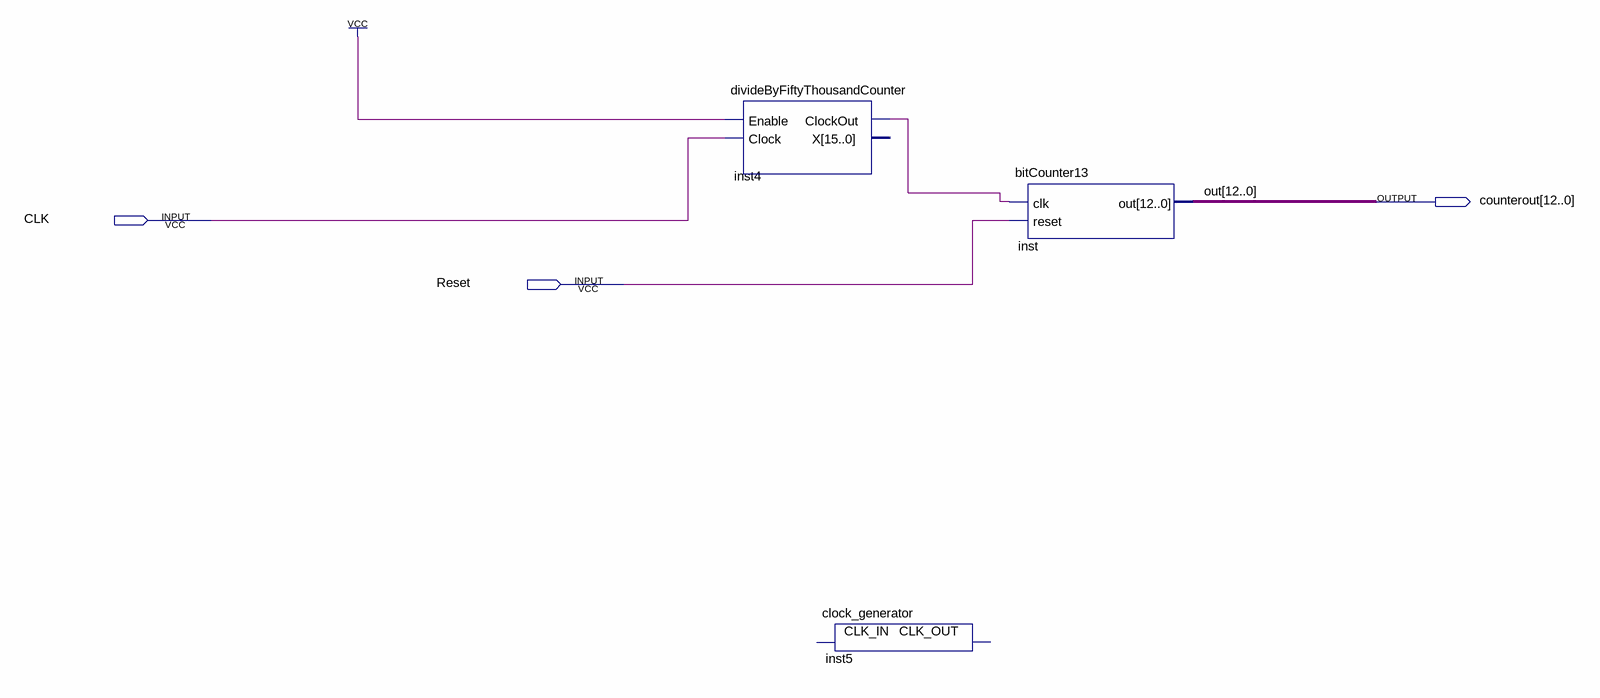
[diagram p0: schematic sheet]
// Quartus schematic bitCounter13test.bdf as structural Verilog: 3 symbols, 3 pins
module bitCounter13test (
  input  CLK,
  input  Reset,
  output [12:0] counterout
);

  wire inst4_clockout;

  divideByFiftyThousandCounter inst4 (.Enable(1'b1), .Clock(CLK), .ClockOut(inst4_clockout));  // open: X
  clock_generator inst5 ();  // open: CLK_IN, CLK_OUT
  bitCounter13 inst (.clk(inst4_clockout), .reset(Reset), .out(counterout));

  // Other names for the same wires on the sheet: out[12:0] = counterout
endmodule
